# EAGLE design oneKey_REV1 (EAGLE 6.5.0)
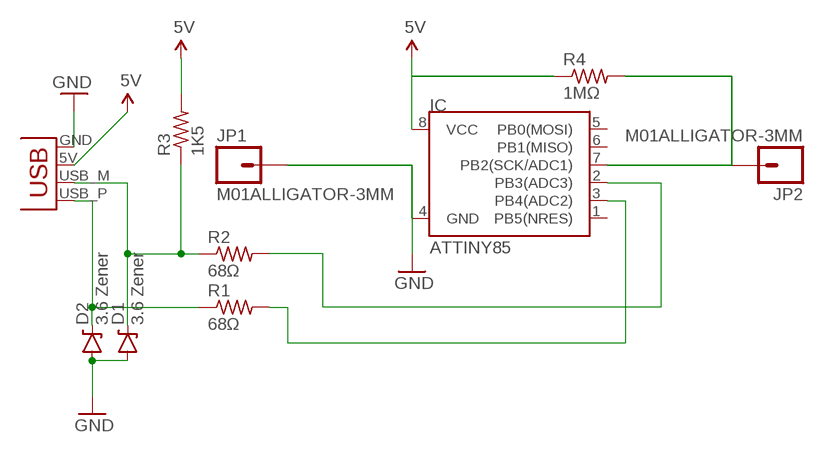
[diagram p0: schematic, sheet 1]

## Parts
D1  3.6 Zener  DIODE-ZENERPTH  [DIODE-ZENER]
D2  3.6 Zener  DIODE-ZENERPTH  [DIODE-ZENER]
IC  ATTINY85  ATTINY45DIP8  [DIP08]
JP1  M01ALLIGATOR-3MM  [1X01_ALLIGATOR_3MM]
JP2  M01ALLIGATOR-3MM  [1X01_ALLIGATOR_3MM]
R1  68Ω  R-US_0204/7  [0204/7]
R2  68Ω  R-US_0204/7  [0204/7]
R3  1K5  R-US_0204/7  [0204/7]
R4  1MΩ  R-US_0204/7  [0204/7]
X1  USBPCB  [USB-A-PCB]

## Nets
5V: IC.8(VCC) R3.2 R4.1 X1.5V(VBUS)
GND: D1.P$2(A) D2.P$2(A) IC.4(GND) JP1.1@0 JP1.1@2 X1.GND
N$1: IC.2(PB3(ADC3)) R2.2
N$2: IC.7(PB2(SCK/ADC1)) JP2.1@0 JP2.1@2 R4.2
N$6: IC.3(PB4(ADC2)) R1.2
N$10: D1.P$1(C) R2.1 R3.1 X1.USB_M(D-)
N$11: D2.P$1(C) R1.1 X1.USB_P(D+)
Unconnected: IC.1(PB5(NRES)) IC.5(PB0(MOSI)) IC.6(PB1(MISO))

## Library data of the parts
D1 D2 = SparkFun-DiscreteSemi:DIODE-ZENER: Zener Diode Production Part - 8199 3.4V Zener Voltage
IC = SparkFun:ATTINY45: Atmel ATTiny45
JP1 JP2 = SparkFun-Connectors:M01: Header 1 Standard 1-pin 0.1" header. Use with straight break away headers (SKU : PRT-00116), right angle break away headers (PRT-00553), swiss pins (PRT-00743), machine pins (PRT-00117), and female headers (PRT-00115).
R1-R4 = resistor:R-US_: RESISTOR, American symbol
X1 = SparkFun:USB: USB Connectors USB-B-PTH is fully proven SKU : PRT-00139 USB-miniB is fully proven SKU : PRT-00587 USB-A-PCB is untested. USB-A-H is throughly reviewed, but untested. Spark Fun Electronics SKU : PRT-00437 USB-B-SMT is throughly reviewed, but untested. Needs silkscreen touching up. USB-A-S has not been used/tested USB-MB-H has not been used/tested

## Board
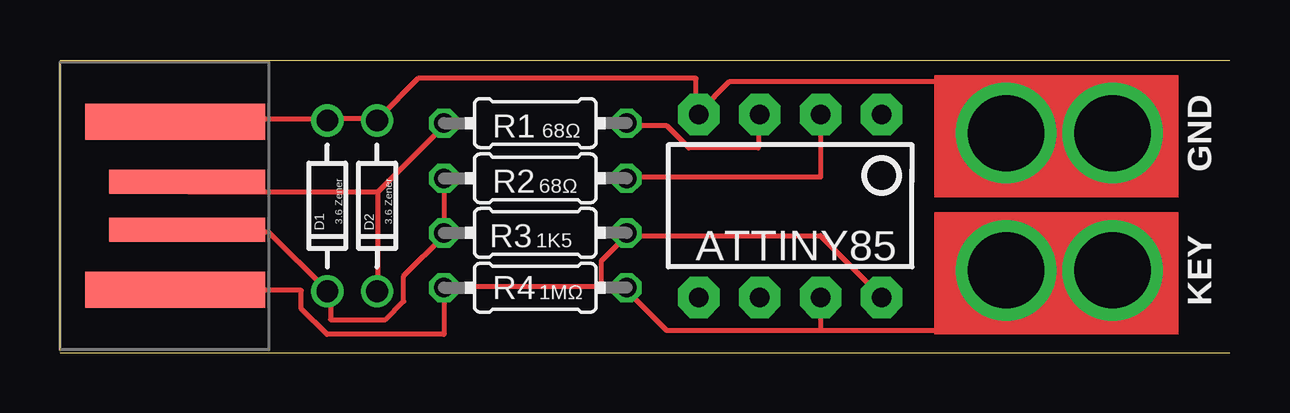
[diagram p1: board, top side]
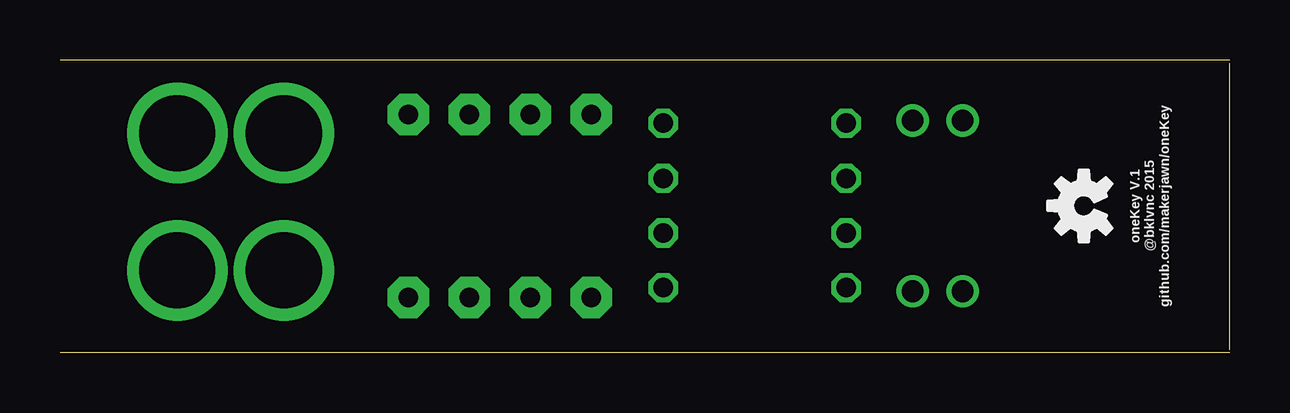
[diagram p2: board, bottom side, seen from below]

Size 48.77 x 12.19 mm. Coordinates in mm from the lower left corner, seen from the top.
Outline: 0,0.13 0,12.06
Outline: 0,12.19 48.77,12.19
Outline: 0,0 48.77,0
Copper layers (1*16): Top 0.0356mm / dielectric 1.5011mm / Bottom 0.0356mm
Design rules "default": minimum track width 8mil, minimum drill 13mil, track to track 12mil, track to pad 12mil, pad to pad 12mil, via to via 12mil, smd to smd 8mil, copper to edge 15mil, drill to drill 12mil, minimum pad ring 7mil, minimum via ring 7mil, stop-mask expansion 4mil, vias tented up to drill 25mil, thermal gap 10mil

### Footprints (pad centres in the part's own frame; a part is rotated, then mirrored left to right if it is on the bottom)
DIODE-ZENER = drill 0.9: P$1 -3.556,0; P$2 3.556,0
DIP08 = drill 0.813 pad 1.727 octagon: 1 -3.81,-3.81; 2 -1.27,-3.81; 3 1.27,-3.81; 4 3.81,-3.81; 5 3.81,3.81; 6 1.27,3.81; 7 -1.27,3.81; 8 -3.81,3.81
1X01_ALLIGATOR_3MM = drill 3.175: 1@0 0,2.223; 1@2 0,-2.223
0204/7 = drill 0.813 octagon: 1 -3.81,0; 2 3.81,0
USB-A-PCB = smd 7.5 x 1.5: 5V -0.2,-3.5; GND -0.2,3.5 | smd 6.5 x 1: USB_M 0.3,-1; USB_P 0.3,1

### Placement (x,y rotation side)
D1  11.14,6.11 90 top
D2  13.22,6.11 90 top
IC  30.44,6.11 180 top
JP1  41.66,9.14 90 top
JP2  41.66,3.43 90 top
R1  19.81,9.56 0 top
R2  19.81,7.26 0 top
R3  19.81,4.99 0 top
R4  19.81,2.7 0 top
U$4  [OSHW-LOGO-S]  6.1,6.11 90 bottom
X1  5,6.11 0 top

### Tracks (layer width: path | path; a pad name or v marks a point on that pad's centre or on a via)
5V
  Top 0.203: 23.62,4.88 22.55,3.81 22.55,2.74 16,2.74 R4.1 16,0.76 11.12,0.76 10.06,1.83 10.06,2.59 4.88,2.59 X1.5V | 23.62,4.88 31.7,4.88 34.14,2.44 IC.8 | 23.62,4.88 R3.2
GND
  Top 0.203: X1.GND 4.88,9.75 11.12,9.75 D1.P$2 11.28,9.75 13.11,9.75 D2.P$2 13.26,9.75 14.94,11.43 26.52,11.43 26.52,10.06 IC.4 26.67,10.06 27.89,11.28 39.34,11.28 39.34,9.14 JP1.1@0 JP1.1@2
N$1
  Top 0.203: R2.2 23.62,7.32 31.7,7.32 31.7,9.91 IC.2
N$2
  Top 0.203: 31.7,0.91 25.3,0.91 23.62,2.59 R4.2 | 31.7,0.91 31.7,2.29 IC.7 | 31.7,0.91 39.34,0.91 39.34,3.35 JP2.1@0 39.5,3.5 43.76,3.5 JP2.1@2
N$6
  Top 0.203: R1.2 23.62,9.45 25.3,9.45 26.21,8.53 29.11,8.53 29.11,9.91 IC.3
N$10
  Top 0.203: R2.1 R3.1 16,4.88 14.33,3.2 14.33,2.13 13.56,1.37 11.28,1.37 11.28,2.44 D1.P$1 11.12,2.59 8.69,5.03 5.33,5.03 X1.USB_M
N$11
  Top 0.203: 13.26,6.71 16,9.45 R1.1 | 13.26,6.71 13.26,2.59 D2.P$1 | 13.26,6.71 5.33,6.71 5.33,7.01 X1.USB_P
(copper drawn outside any net)
  shapes: Top area x2

### Text on the board
tPlace: GND | KEY
bPlace: oneKey V.1 / @bklvnc 2015 / github.com/makerjawn/oneKey
Reference: Design (schematic, layout, concept) is licensed under the Creative Commons Attribution-ShareAlike 3.0 Unported License: http://creativecommons.org/licenses/by-sa/3.0/ | For full details and license information please see https://github.com/makerjawn/oneKey | Derivative of MaKey MaKey by JoyLabz and Sparkfun and the Digispark | Created by bk, klvnc.me 2015